# Altium schematic sheet FAN_Conrol.SchDoc
size A4; SheetNumber: 7; SheetTotal: 9
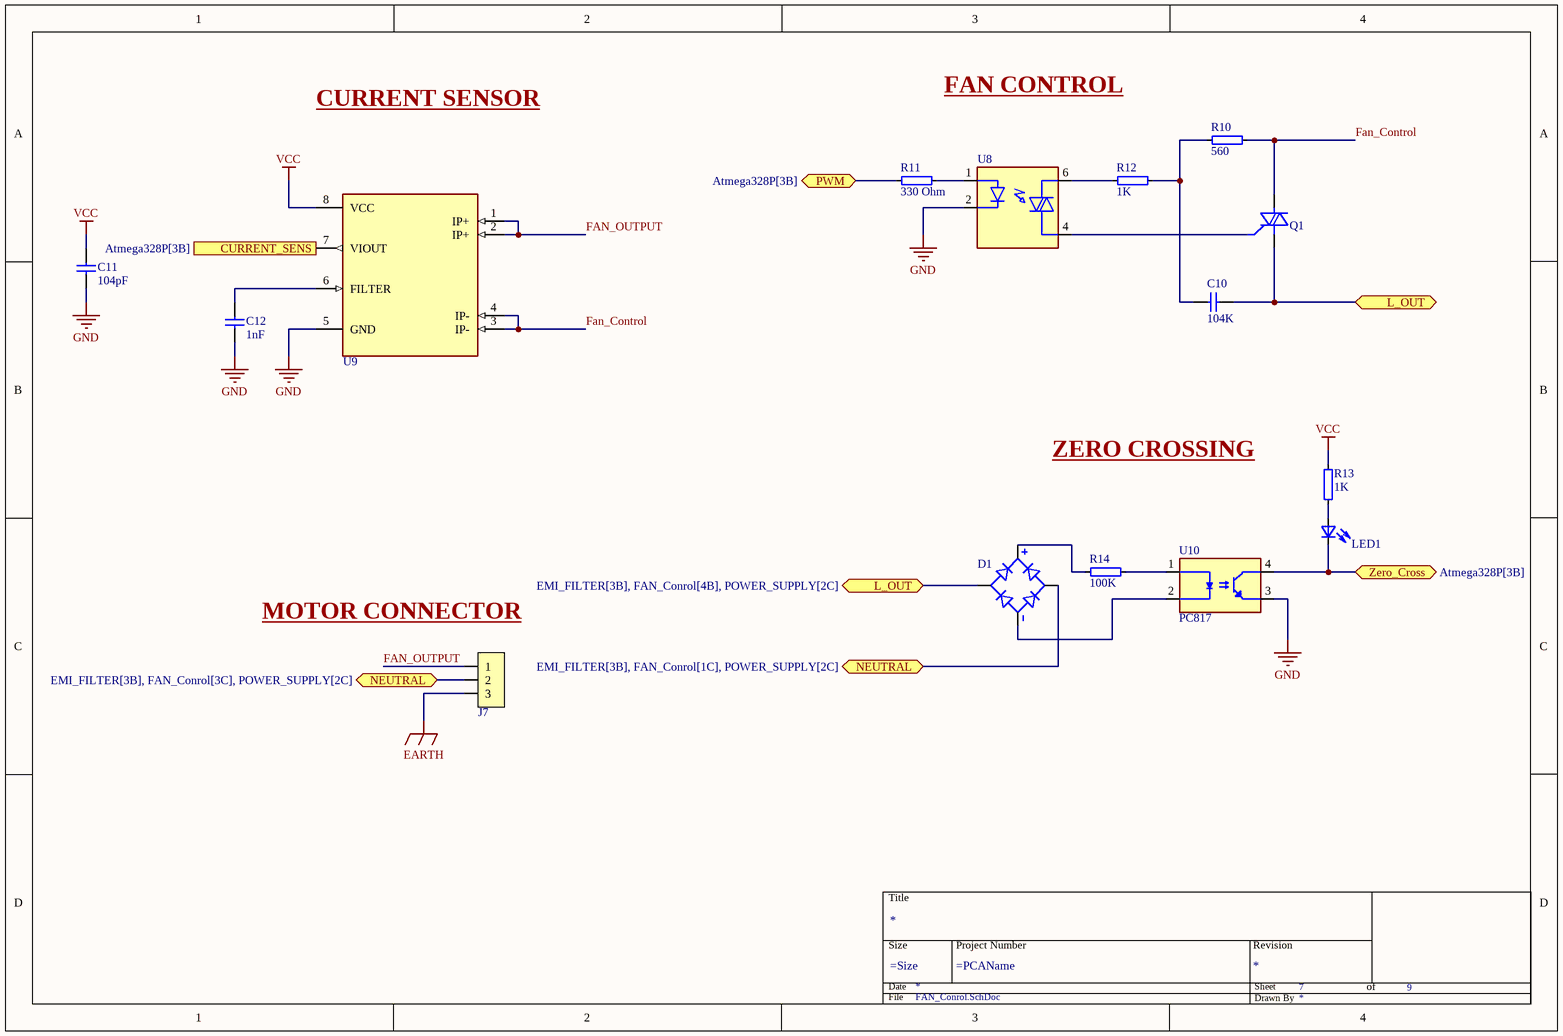
[diagram p0: FAN_Conrol.SchDoc]

## Parts
*  Title Block  (value not drawn)  (graphical)
C10  104K  [CAPRR1500W60L1850T800H1650]
C11  104pF  [CAPC2012X140N]
C12  1nF  [CAPC2012X140N]
D1  DB107-BP  [DIP825W50P509L880H320Q4]  (value not drawn)
J7  1935174  [PHOENIX_1935174]  (value not drawn)
LED1  LED_0603  [LED_KP-2012]  (value not drawn)
Q1  BTA16-600CW3G  [TO254P1028X482X1968-3]  (value not drawn)
R10  560  [RES_ROX2S_TYCO_TYC]
R11  330 Ohm  [RESC2012X65N]
R12  1K  [RES_ROX2S_TYCO_TYC]
R13  1K  [RESC2012X65N]
R14  100K  [RES_ROX2S_TYCO_TYC]
U8  MOC3021  [DIP762W45P254L889H508Q6]  (value not drawn)
U9  ACS712ELCTR  [SOIC127P600X175-8N]  (value not drawn)
U10  PC817  [DIP762W50P254L495H455Q4]

## Ports
CURRENT_SENS (out, see Atmega328P[3B]), L_OUT (bidir, see EMI_FILTER[3B], FAN_Conrol[3C], POWER_SUPPLY[2C]), L_OUT (bidir, see EMI_FILTER[3B], FAN_Conrol[4B], POWER_SUPPLY[2C]), NEUTRAL (bidir, see EMI_FILTER[3B], FAN_Conrol[1C], POWER_SUPPLY[2C]), NEUTRAL (bidir, see EMI_FILTER[3B], FAN_Conrol[3C], POWER_SUPPLY[2C]), PWM (bidir, see Atmega328P[3B]), Zero_Cross (bidir, see Atmega328P[3B])

## Nets
EARTH: J7.3
GND: C11.1 C12.1 U8.2(CATODE) U9.5(GND) U10.3(EMITTER)
VCC: C11.2 R13.2 U9.8(VCC)
CURRENT_SENS: U9.7(VIOUT) ; port CURRENT_SENS
Fan_Control: Q1.2(MT2) R10.2 U9.3(IP-) U9.4(IP-)
FAN_OUTPUT: J7.1 U9.1(IP+) U9.2(IP+)
L_OUT: C10.2 D1.4(AC2) Q1.1(MT1) ; port L_OUT
NEUTRAL: D1.3(AC1) J7.2 ; port NEUTRAL
PWM: R11.1 ; port PWM
Zero_Cross: LED1.2(Cathode) U10.4(COLLECTOR) ; port Zero_Cross
NetC10_1: C10.1 R10.1 R12.2
NetC12_2: C12.2 U9.6(FILTER)
NetD1_1: D1.1(POS) R14.1
NetD1_2: D1.2(NEG) U10.2(CATHODE)
NetLED1_1: LED1.1(Anode) R13.1
NetQ1_3: Q1.3(G) U8.4(MAIN_TERM2)
NetR11_2: R11.2 U8.1(ANODE)
NetR12_1: R12.1 U8.6(MAIN_TERM1)
NetR14_2: R14.2 U10.1(ANODE)

## Notes on the sheet
- CURRENT SENSOR
- FAN CONTROL
- ZERO CROSSING
- (near J7) MOTOR CONNECTOR
- (in symbol Title Block) Title; Size; Project Number; Revision; Date; Sheet; of; File; Drawn By

## Library data of the parts
C10 = 0.1uF 300V: Capacitor, Metalized Polypropylene Film,300VAC, 0.1uF, +-10%; Part Number: 100nF 300V; Manufacturer Part Number: 100nF 300V; Pin Count: 2; Publisher: Metal Circuits; Value: 104K
C11 C12 = CAP_0805: Part Number: CAP_0805; Pin Count: 2; Publisher: Metal Circuits
  C11: Value: 104pF
  C12: Value: 1nF
D1 = DB107-BP: Bridge Rectifier Single Phase Standard 1 kV Through Hole DB-1; Manufacturer: MCC; Part Number: DB107-BP; Manufacturer Part Number: DB107-BP; Pin Count: 4; Publisher: Metal Circuits; Value: DB107-BP
J7 = 1935174: 3 Position Wire to Board Terminal Block Horizontal with Board 0.197" (5.00mm) Through Hole; Manufacturer: Phoenix Contact; Part Number: 1935174; Manufacturer Part Number: 1935174; Pin Count: 3; Publisher: Metal Circuits; Value: 1935174
LED1 = LED_0603: LED SMD 0603; Part Number: LED_0603; Manufacturer Part Number: LED_0603; Pin Count: 2; Publisher: Metal Circuits; Value: LED_0603
Q1 = BTA16-600CW3G: TRIAC Standard 600V 16A Through Hole TO-220AB; Manufacturer: Littelfuse Inc.; Part Number: BTA16-600CW3G; Manufacturer Part Number: BTA16-600CW3G; Pin Count: 3; Publisher: Metal Circuits; Value: BTA16-600CW3G
R10 = RES 2Watt: Carbon Film Through Hole Resistor 2Watt 1%; Part Number: RES 2 Watt; Pin Count: 2; Publisher: Metal Circuits; Value: 560
R11 R13 = RES_0805: RES SMD 1% 1/10W 0805; Part Number: RES_0805; Pin Count: 2; Publisher: Metal Circuits; FootPrint Doc: 0805
  R11: Value: 330 Ohm
  R13: Value: 1K
R12 R14 = RES 1Watt: Carbon Film Through Hole Resistor 1Watt 1%; Part Number: RES 1 Watt; Pin Count: 2; Publisher: Metal Circuits
  R12: Value: 1K
  R14: Value: 100K
U8 = MOC3021: Optoisolator Triac Output 5000Vrms 1 Channel 6-DIP; Manufacturer: Lite-On; Part Number: MOC3021; Manufacturer Part Number: MOC3021; Pin Count: 6; Publisher: Metal Circuits; Value: MOC3021
U9 = ACS712ELCTR-05B-T: Current Sensor 5A 1 Channel Hall Effect, Open Loop Bidirectional 8-SOIC (0.154", 3.90mm Width); Part Number: ACS712ELCTR; Manufacturer Part Number: ACS712ELCTR; Pin Count: 8; Publisher: Metal Circuits; Value: ACS712ELCTR; FootPrint Doc: SOIC-8
U10 = PC817: Optoisolator Transistor Output - 1 Channel 4-DIP; Manufacturer: SHARP; Part Number: PC817; Manufacturer Part Number: PC817; Pin Count: 4; Publisher: Metal Circuits; Value: PC817; FootPrint Doc: DIP-4